# Altium schematic sheet Master.SchDoc
size A4
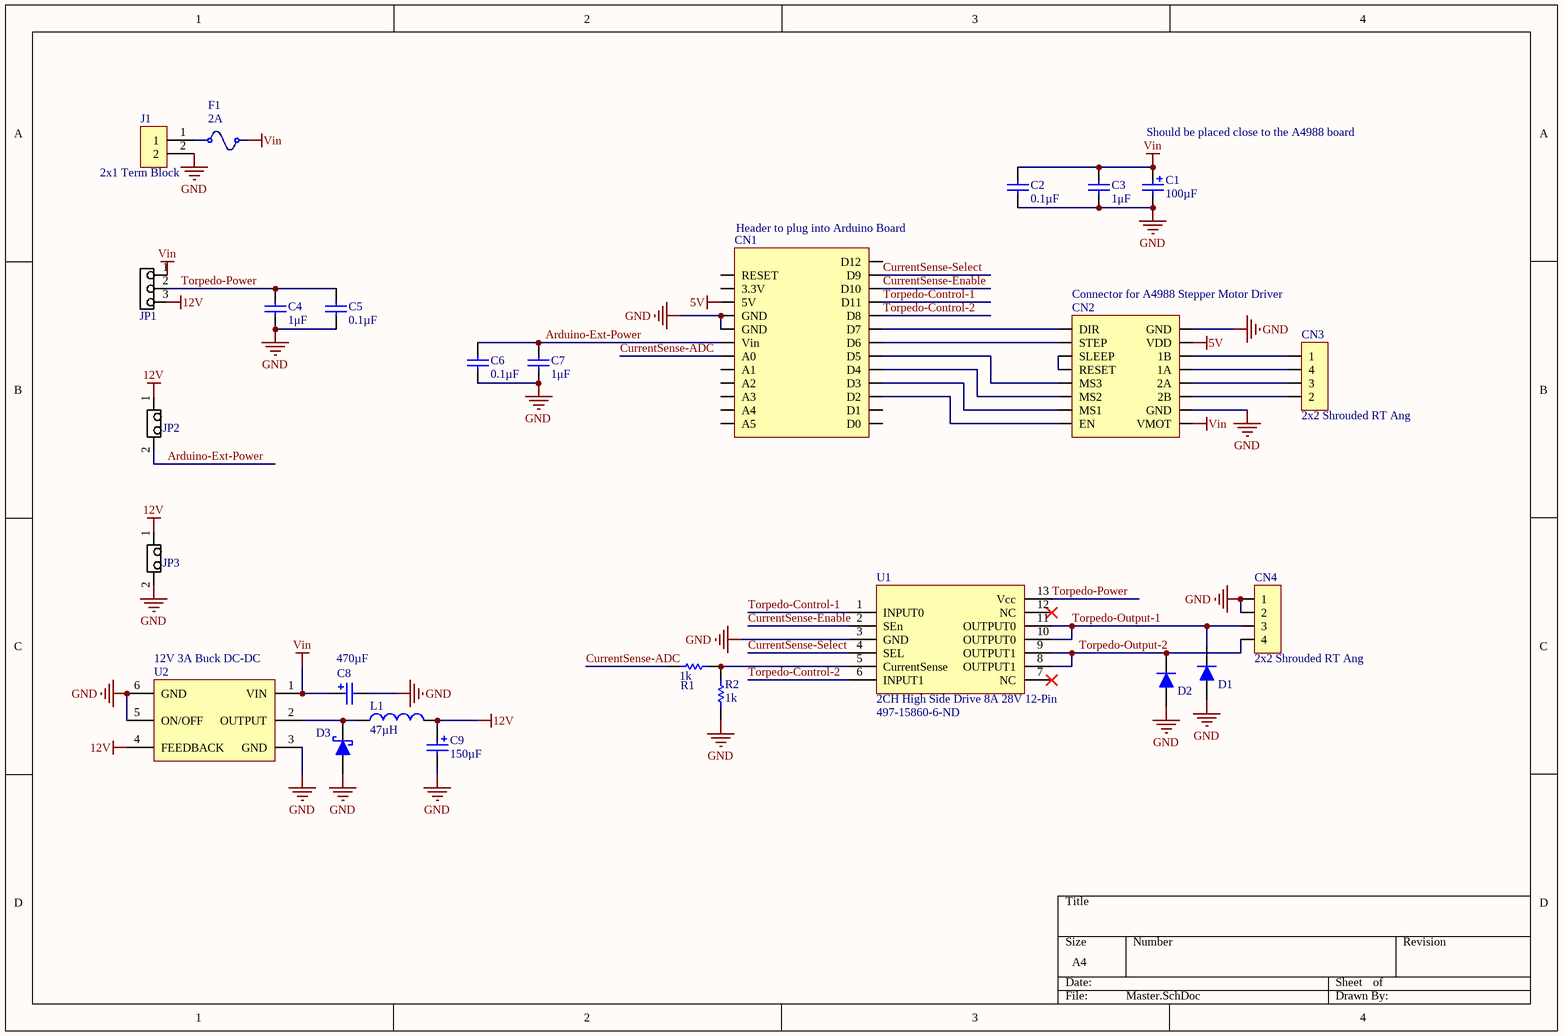
[diagram p0: Master.SchDoc]

## Parts
C1  100µF  [Radial_CAN_6.6mm]
C2  Capacitance: 0.1µF  [CAPC1608N(0603")]  (hidden comment: 0.1uF, 50V, 10%, X7R, 0603)
C3  1μF  [CAPC2012N(0805")]
C4  1μF  [CAPC2012N(0805")]
C5  Capacitance: 0.1µF  [CAPC1608N(0603")]  (hidden comment: 0.1uF, 50V, 10%, X7R, 0603)
C6  Capacitance: 0.1µF  [CAPC1608N(0603")]  (hidden comment: 0.1uF, 50V, 10%, X7R, 0603)
C7  1μF  [CAPC2012N(0805")]
C8  470µF  [12.5mm Dia Radial THD]
C9  150µF  [6.3mm Dia Radial SMD]
CN1  Header to plug into Arduino Board  [Arduino Shield Reduced Pin]
CN2  Connector for A4988 Stepper Motor Driver  [A4988 Stepper Motor Driver Header]
CN3  2x2 Shrouded RT Ang  [HEADER, MALE, Shrouded, 4POS, 2MM, RT ANG,THT]
CN4  2x2 Shrouded RT Ang  [HEADER, MALE, Shrouded, 4POS, 2MM, RT ANG,THT]
D1  JD 2A 600V  [DO-214AA]  (value not drawn)
D2  JD 2A 600V  [DO-214AA]  (value not drawn)
D3  TSSA5U50E3GCT-ND  [DO-214AC]  (value not drawn)
F1  2A  [1206 SMD]
J1  2x1 Term Block  [2X1 Terminal Blocks]
JP1  1x3 Male Jumper  [Header, Male, 1x3, Pitch: 0.1" (2.54mm),THT]  (value not drawn)
JP2  1X2 Pin Head  [2X1 Males Header]  (value not drawn)
JP3  1X2 Pin Head  [2X1 Males Header]  (value not drawn)
L1  47µH  [12mm SMD]
R1  1k  [RESC1608N(0603")]
R2  1k  [RESC1608N(0603")]
U1  2CH High Side Drive 8A 28V 12-Pin  Supplier Part Number 1: 497-15860-6-ND  [PowerSSO-12]
U2  12V 3A Buck DC-DC  [5-DDPAK]

## Nets
5V: CN1.5(5V) CN2.10(VDD)
12V: C9.1(Anode) JP1.3 JP2.1 JP3.1 L1.2 U2.4(FEEDBACK)
GND: C1.2(Cathode) C2.1(Anode) C3.1(Anode) C4.1(Anode) C5.1(Anode) C6.1(Anode) C7.1(Anode) C8.2(Cathode) C9.2(Cathode) CN1.6(GND) CN1.7(GND) CN2.9(GND) CN2.15(GND) CN4.1 CN4.2 D1.A(Anode) D2.A(Anode) D3.1(Anode) J1.2 JP3.2 R2.1 U1.3(GND) U2.3(GND) U2.5(ON/OFF) U2.6(GND)
Vin: C1.1(Anode) C2.2(Cathode) C3.2(Cathode) C8.1(Anode) CN2.16(VMOT) F1.2 JP1.1 U2.1(VIN)
Arduino-Ext-Power: C6.2(Cathode) C7.2(Cathode) CN1.8(Vin) JP2.2
CurrentSense-ADC: CN1.9(A0) R1.1
CurrentSense-Enable: CN1.25(D10) U1.2(SEn)
CurrentSense-Select: CN1.24(D9) U1.4(SEL)
Torpedo-Control-1: CN1.26(D11) U1.1(INPUT0)
Torpedo-Control-2: CN1.23(D8) U1.6(INPUT1)
Torpedo-Output-1: CN4.3 D1.K(Cathode) U1.10(OUTPUT0) U1.11(OUTPUT0)
Torpedo-Output-2: CN4.4 D2.K(Cathode) U1.8(OUTPUT1) U1.9(OUTPUT1)
Torpedo-Power: C4.2(Cathode) C5.2(Cathode) JP1.2 U1.13(Vcc)
NetCN1_17: CN1.17(D2) CN2.1(EN)
NetCN1_18: CN1.18(D3) CN2.2(MS1)
NetCN1_19: CN1.19(D4) CN2.3(MS2)
NetCN1_20: CN1.20(D5) CN2.4(MS3)
NetCN1_21: CN1.21(D6) CN2.7(STEP)
NetCN1_22: CN1.22(D7) CN2.8(DIR)
NetCN2_5: CN2.5(RESET) CN2.6(SLEEP)
NetCN2_11: CN2.11(1B) CN3.1
NetCN2_12: CN2.12(1A) CN3.4
NetCN2_13: CN2.13(2A) CN3.3
NetCN2_14: CN2.14(2B) CN3.2
NetD3_2: D3.2(Cathode) L1.1 U2.2(OUTPUT)
NetF1_1: F1.1 J1.1
NetR1_2: R1.2 R2.2 U1.5(CurrentSense)

Not connected (* = marked no-connect by the designer): CN1 3(RESET) 4(3.3V) 10(A1) 11(A2) 12(A3) 13(A4) 14(A5) 15(D0) 16(D1) 27(D12); U1 7(NC)* 12(NC)*

## Notes on the sheet
- Should be placed close to the A4988 board

## Library data of the parts
C1 = 100uF, 35V, 20%, Alum, SMD: 100µF 35V Aluminum Electrolytic Capacitors Radial, Can - SMD 1000 Hrs @ 105°C; Created By: Poorna Chander Kalidas; PackageDescription: Can; Value: 100µF; Date Created: 2018-06-01; Supplier 1: Digi-Key; Supplier Part Number 1: 493-2203-2-ND
C2 C5 C6 = 0.1uF, 50V, 10%, X7R, 0603: 0.1µF ±20% Ceramic Capacitor X7R 0603 (1608 Metric); Mounting Type: Surface Mount, MLCC; Operating Temperature: -55°C ~ 125°C; Package / Case: 0603 (1608 Metric); ComponentLink1Description: Digi-Key; ComponentLink1URL: https://www.digikey.ca/product-detail/en/tdk-corporation/C1608X7R1H104M080AA/445-5098-1-ND/2093713; Supplier 1: Digi-Key; Created By: Poorna Chander Kalidas; Supplier Part Number 1: 445-5098-1-ND
C3 C4 C7 = 1uF 50V 0805 SMD, Ceramic: 1µF ±10% Ceramic Capacitor X5R 0805 (2012 Metric); PackageDescription: Chip Capacitor; Value: 1μF; Created By: Poorna Chander Kalidas; Date Created: 2018-06-14; Supplier 1: Digi-Key; Supplier Part Number 1: 490-10743-6-ND
C8 = 470uF, 50V, 20%, Alum, SMD: 470µF 50V Aluminum Electrolytic Capacitors Radial, Can 5000 Hrs @ 105°C; Created By: Poorna Chander Kalidas; PackageDescription: Can; Value: 470µF; Date Created: 2018-06-13; ComponentLink1Description: Digi-Key; ComponentLink1URL: https://www.digikey.ca/product-detail/en/panasonic-electronic-components/EEU-FM1H471/P12400-ND/613761; Supplier 1: Digi-Key; Supplier Part Number 1: P12400-ND
C9 = 150uF, 35V, 20%, Alum, SMD: 150µF 35V Aluminum Electrolytic Capacitors Radial, Can - SMD 160 mohm @ 100kHz 2000 Hrs @ 105°C; Created By: Poorna Chander Kalidas; PackageDescription: Can; Value: 150µF; Date Created: 2018-06-13; Supplier 1: Digi-Key; Supplier Part Number 1: PCE5017DKR-ND
CN1 = Arduino Shield Header Reduced Pin: 1x6 Header  x2 / 1x8 Header / 1x5 Header / Reduced Pin Version - Does not connect to all pin on the Arduino / Pitch: 0.1" (2.54mm), Contact Length 0.394" (10.00mm) Through hole; Made Bates: Poorna Chander Kalidas; Supplier 1: Digi-Key; Supplier 2: Digi-Key; Supplier 3: Digi-Key; Supplier Part Number 1: SAM8865-ND; Supplier Part Number 2: SAM1206-05-ND; Supplier Part Number 3: SSW-106-03-T-S-ND
CN2 = Connector for A4988 Stepper Motor Driver: Header, Female, 2x8, Pitch: 0.1" (2.54mm),THT; Created By: Poorna Chander Kalidas; Supplier 1: Digi-Key; Supplier Part Number 1: S7006-ND
CN3 CN4 = Header, Male, 2x2 Conn, Shrouded, THT, 2MM RT ANG TIN: Header, Male, 2x2, Pitch: 0.1" (2.54mm), THT; Publisher: AUVic; Date Published: 2018-06-12; Last Updated: *; Reviewed By: *; Created By: Poorna Chander Kalidas; Supplier 1: Digi-Key; Supplier 2: Digi-Key; Supplier Part Number 1: H10244-ND; Supplier Part Number 2: H2019-ND
D1 D2 = JD 2A 600V: Junction Diode 2A 600V; Created By: Poorna Chander Kalidas; Publisher: AUVic; Date Created: 2018-06-07; ComponentLink1Description: Digi-Key; ComponentLink1URL: https://www.digikey.ca/product-detail/en/smc-diode-solutions/S2JTR/1655-1739-1-ND/6674450; Supplier 1: Digi-Key; Supplier Part Number 1: 1655-1739-1-ND
D3 = TSSA5U50E3GCT-ND: Diode Schottky 50V 5A Surface Mount DO-214AC (SMA); Created By: Poorna Chander Kalidas; Date Created: 2018-06-01; Supplier 1: Digi-Key; Supplier Part Number 1: TSSA5U50 E3GCT-ND
F1 = SMD Fuse, 2A, 63V,: Created By: Poorna Chander Kalidas; Date Created: 2018-06-07; Type: SMD; Supplier 1: Digi-Key; ComponentLink1Description: Digi-Key; ComponentLink1URL: https://www.digikey.ca/product-detail/en/bel-fuse-inc/C1F-2/507-1881-1-ND/4968159; Supplier Part Number 1: 507-1881-6-ND; Current: 2A
J1 = 2x1 Terminal Block: Made by: Andy Bates; Supplier 1: Digikey; Supplier Part Number 1: ED2740-ND
JP1 = 1x3 Male Jumper: Made By: Poorna Chander Kalidas; Supplier 1: Digi-Key; Supplier Part Number: 1849-1003-ND
JP2 JP3 = 1x2 Male Header: Made By: Andy Bates; Supplier 1: Digikey; Supplier 1 Part Number: 952-3073-ND
L1 = 47µH 3.8A Inductor: 47µH Shielded Wirewound Inductor 3.8A 60 mOhm Max Nonstandard; Created By: Poorna Chander Kalidas; Created On: 2018-06-13; Value: 47µH; ComponentLink1Description: Digi-Key; ComponentLink1URL: https://www.digikey.ca/product-detail/en/wurth-electronics-inc/7447709470/732-1246-1-ND/1639307; Supplier 1: Digi-Key; Supplier Part Number 1: 732-1246-1-ND
R1 R2 = 1kR, 1%, 1/10W , 0603, SMD: Created By: Andy Bates; Publisher: AUVic; Date Created: 2017-05-10; Value: 1k; Supplier 1: Digikey; Supplier Part Number 1: 311-1.00KHRCT-ND
U1 = 2CH High Side Drive 8A 28V 12-Pin: 2 Channel High Side Drive MOSFET controlable by logic signal 12-Pin; Supplier 1: Digi-Key; ComponentLink1Description: Digi-Key; ComponentLink1URL: https://www.digikey.ca/product-detail/en/stmicroelectronics/VND7140AJ12TR/497-15860-1-ND/5322005; Created By: Poorna Chander Kalidas; Date Created: 2018-06-13
U2 = 12V 3A Buck DC-DC: Buck Switching Regulator IC Positive Fixed 12V 1 Output 3A TO-263-6, D²Pak (5 Leads + Tab), TO-263BA; Supplier 1: Digi-Key; Created By: Poorna Chander Kalidas; Supplier Part Number 1: 576-2130-ND; ComponentLink1Description: Digi-Key; ComponentLink1URL: https://www.digikey.ca/product-detail/en/microchip-technology/LM2576-12WU/576-2130-ND/1027675